# EAGLE schematic Micromouse Schematic (EAGLE 9.7.0)
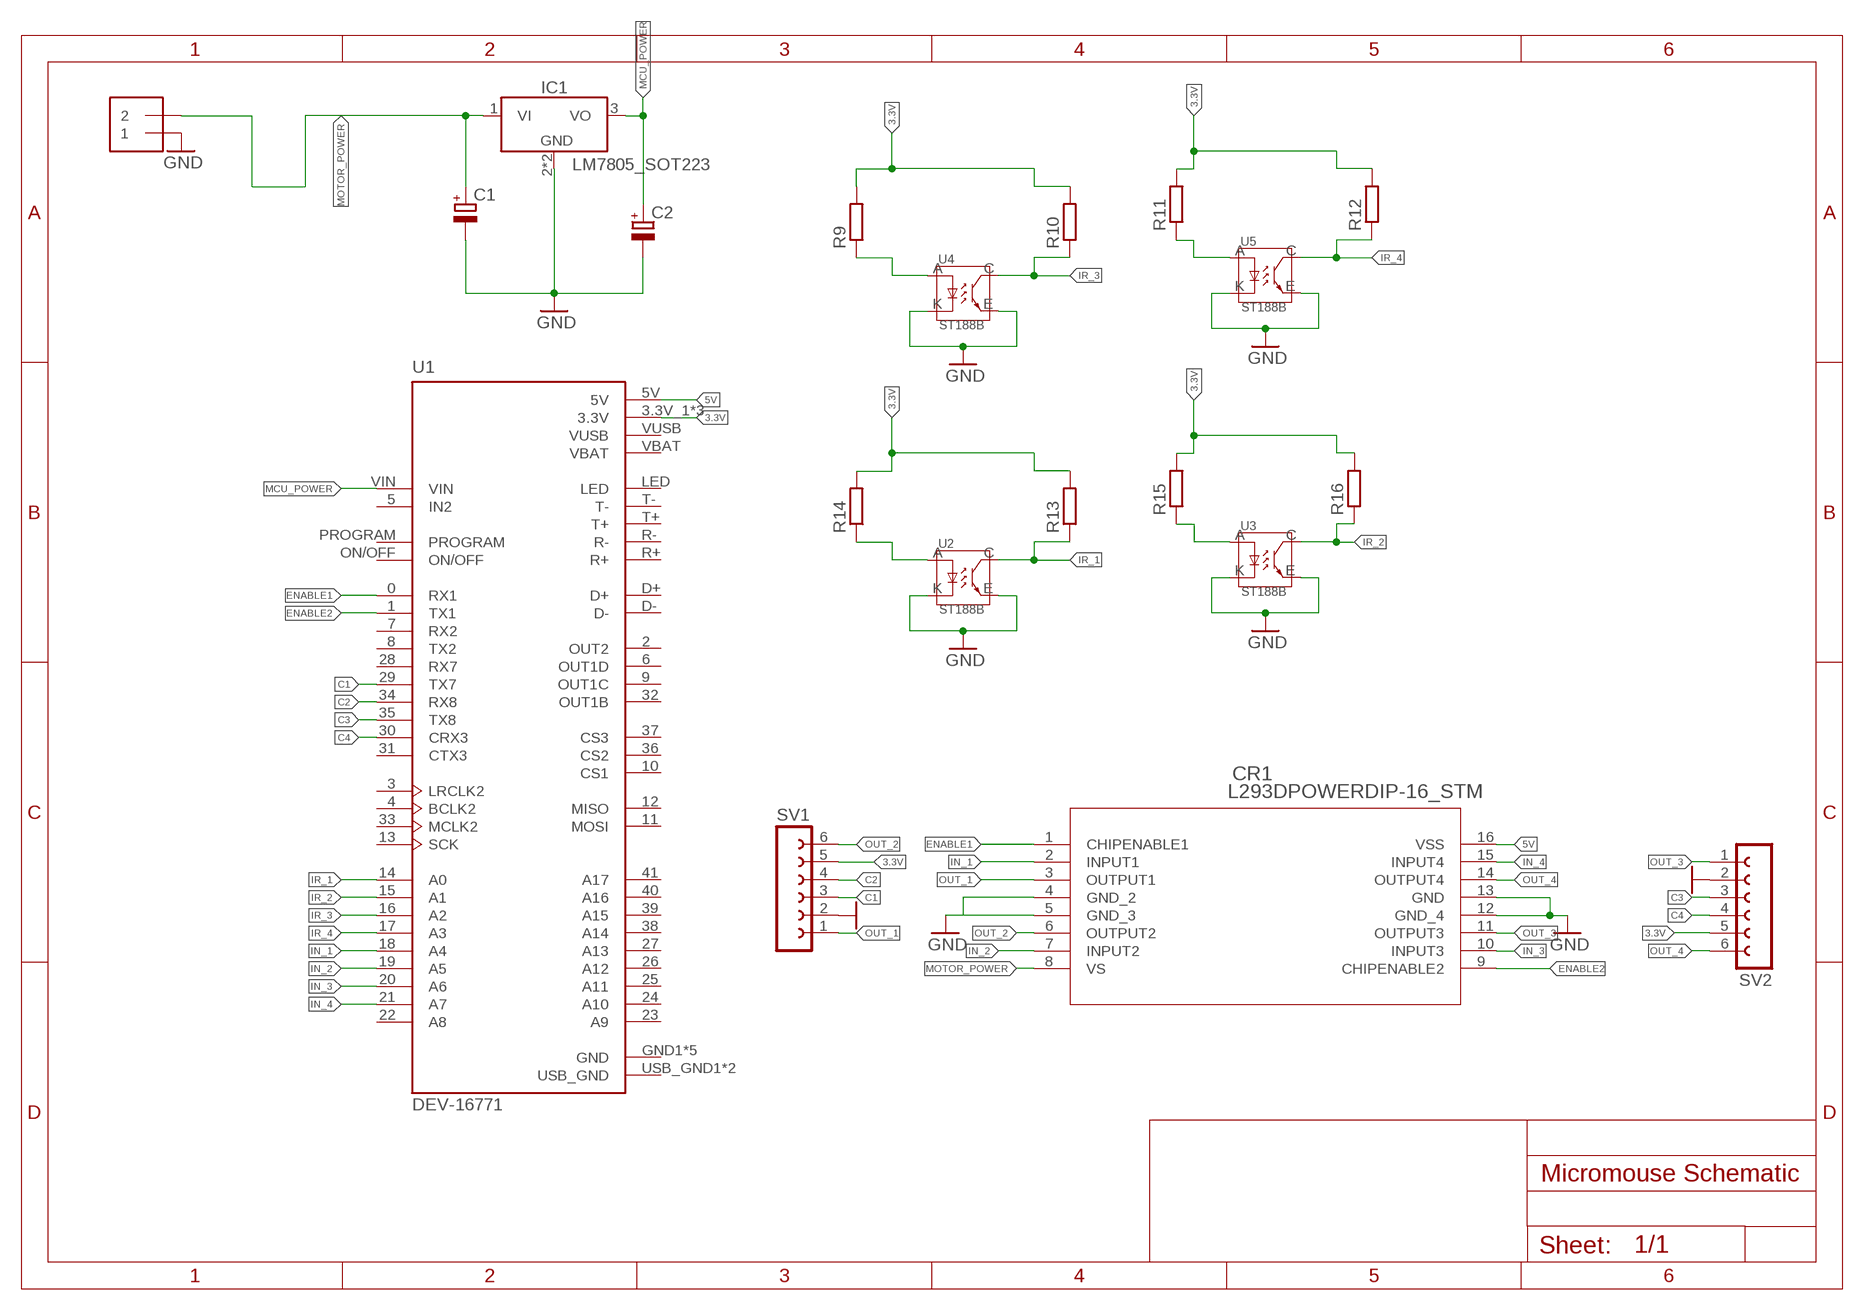
[diagram p0: schematic, sheet 1]

## Parts
C1  CPOL-EUE2-5  [E2-5]
C2  CPOL-EUE2-5  [E2-5]
CR1  L293DPOWERDIP-16_STM  [POWERDIP-16_STM]
IC1  LM7805_SOT223  [SOT230P700X170-4]
J1  1X2-3.5MM  [1X2-3.5MM]
R9  R-EU_R1206  [R1206]
R10  R-EU_R1206  [R1206]
R11  R-EU_R1206  [R1206]
R12  R-EU_R1206  [R1206]
R13  R-EU_R1206  [R1206]
R14  R-EU_R1206  [R1206]
R15  R-EU_R1206  [R1206]
R16  R-EU_R1206  [R1206]
SV1  FE06-1  [FE06]
SV2  FE06-1  [FE06]
U1  DEV-16771  [MODULE_DEV-16771]
U2  ST188B  [ST188-B]
U3  ST188B  [ST188-B]
U4  ST188B  [ST188-B]
U5  ST188B  [ST188-B]

## Nets
3.3V: R9.2 R10.2 R11.2 R12.2 R13.2 R14.2 R15.2 R16.2 SV1.5 SV2.5 U1.3.3V_1(3.3V) U1.3.3V_2(3.3V) U1.3.3V_3(3.3V)
5V: CR1.16(VSS) U1.5V
C1: SV1.3 U1.29(TX7)
C2: SV1.4 U1.34(RX8)
C3: SV2.3 U1.35(TX8)
C4: SV2.4 U1.30(CRX3)
ENABLE1: CR1.1(CHIPENABLE1) U1.0(RX1)
ENABLE2: CR1.9(CHIPENABLE2) U1.1(TX1)
GND: C1.- C2.- CR1.5(GND_3) CR1.12(GND_4) CR1.13(GND) IC1.2(GND) IC1.4(GND) J1.1 SV1.2 SV2.2 U2.E U2.K(F) U3.E U3.K(F) U4.E U4.K(F) U5.E U5.K(F)
IN_1: CR1.2(INPUT1) U1.18(A4)
IN_2: CR1.7(INPUT2) U1.19(A5)
IN_3: CR1.10(INPUT3) U1.20(A6)
IN_4: CR1.15(INPUT4) U1.21(A7)
IR_1: R13.1 U1.14(A0) U2.C
IR_2: R16.1 U1.15(A1) U3.C
IR_3: R10.1 U1.16(A2) U4.C
IR_4: R12.1 U1.17(A3) U5.C
MCU_POWER: C2.+ IC1.3(VO) U1.VIN
MOTOR_POWER: C1.+ CR1.8(VS) IC1.1(VI) J1.2
N$1: R14.1 U2.A
N$2: R15.1 U3.A
N$3: R9.1 U4.A
N$4: R11.1 U5.A
N$8: CR1.4(GND_2)
OUT_1: CR1.3(OUTPUT1) SV1.1
OUT_2: CR1.6(OUTPUT2) SV1.6
OUT_3: CR1.11(OUTPUT3) SV2.1
OUT_4: CR1.14(OUTPUT4) SV2.6
Unconnected: U1.2(OUT2) U1.3(LRCLK2) U1.4(BCLK2) U1.5(IN2) U1.6(OUT1D) U1.7(RX2) U1.8(TX2) U1.9(OUT1C) U1.10(CS1) U1.11(MOSI) U1.12(MISO) U1.13(SCK) U1.22(A8) U1.23(A9) U1.24(A10) U1.25(A11) U1.26(A12) U1.27(A13) U1.28(RX7) U1.31(CTX3) U1.32(OUT1B) U1.33(MCLK2) U1.36(CS2) U1.37(CS3) U1.38(A14) U1.39(A15) U1.40(A16) U1.41(A17) U1.D+ U1.D- U1.LED U1.ON/OFF U1.PROGRAM U1.R+ U1.R- U1.T+ U1.T- U1.VBAT U1.VUSB

## Power pins joined to a net without a drawn wire
GND: U1.GND1(GND) U1.GND2(GND) U1.GND3(GND) U1.GND4(GND) U1.GND5(GND)
USB_GND: U1.USB_GND1(USB_GND) U1.USB_GND2(USB_GND)

## Library data of the parts
C1 C2 = rcl:CPOL-EU: POLARIZED CAPACITOR, European symbol; SPICEPREFIX: C
CR1 = 2024-05-25_23-34-21_Library:L293D; COPYRIGHT: Copyright (C) 2024 Ultra Librarian. All rights reserved.; MANUFACTURER_PART_NUMBER: L293D; MFR_NAME: STMicroelectronics
IC1 = IC_Power-Management:LM7805: 5V Voltage Regulator Reference Datasheet <https://www.ti.com/lit/ds/symlink/lm340.pdf>; CATEGORY: IC_Logic; DESCRIPTION: 5V Voltage Regulator; MANUFACTURER: Generic; MPN: Generic; SERIES: LM7805; SUB-CATEGORY: Voltage Regulator; TYPE: 5V
J1 = adafruit:1X2: 3.5mm Terminal block http://www.ladyada.net/library/pcb/eaglelibrary.html
R9-R16 = rcl:R-EU_: RESISTOR, European symbol; SPICEPREFIX: R
SV1 SV2 = con-lsta:FE06-1: FEMALE HEADER; OC_FARNELL: unknown; OC_NEWARK: unknown
U1 = DEV-16771:DEV-16771: RT1062 Teensy 4.1 i.MX ARM Cortex-M7 MPU Embedded Evaluation Board Check availability <https://pricing.snapeda.com/parts/DEV-16771/SparkFun%20Electronics/view-part?ref=eda>; AVAILABILITY: In Stock; CHECK_PRICES: https://www.snapeda.com/parts/DEV-16771/SparkFun+Electronics/view-part/?ref=eda; DESCRIPTION: RT1062 Teensy 4.1 series ARM® Cortex®-M7 MPU Embedded Evaluation Board; MF: SparkFun Electronics; MP: DEV-16771; PACKAGE: None; PRICE: None; SNAPEDA_LINK: https://www.snapeda.com/parts/DEV-16771/SparkFun+Electronics/view-part/?ref=snap
U2-U5 = ST188:ST188: Check availability <https://pricing.snapeda.com/parts/ST188/Stackpole%20Electronics%20Inc./view-part?ref=eda>; AVAILABILITY: In Stock; CHECK_PRICES: https://www.snapeda.com/parts/ST188/Stackpole+Electronics+Inc./view-part/?ref=eda; DESCRIPTION: RES SMD 887K OHM 0.5% 1/16W 0402; MF: Stackpole Electronics Inc.; MP: ST188; PACKAGE: None; PRICE: None; SNAPEDA_LINK: https://www.snapeda.com/parts/ST188/Stackpole+Electronics+Inc./view-part/?ref=snap